# EAGLE schematic CrossBoard v1 (EAGLE 5.11)
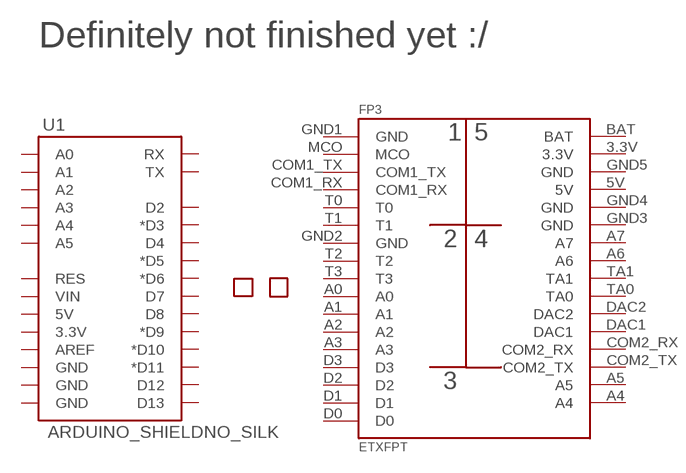
[diagram p0: schematic, sheet 1]

## Parts
FP1  HPBFPNORM  [*HPBFP]
FP2  LPBFPNORM  [*LPBFP]
FP3  ETXFPT  [*ETXFP]
U1  ARDUINO_SHIELDNO_SILK  [DUEMILANOVE_VIAS]
Unconnected: FP3.3.3V FP3.5V FP3.A0 FP3.A1 FP3.A2 FP3.A3 FP3.A4 FP3.A5 FP3.A6 FP3.A7 FP3.BAT FP3.COM1_RX FP3.COM1_TX FP3.COM2_RX FP3.COM2_TX FP3.D0 FP3.D1 FP3.D2 FP3.D3 FP3.DAC1 FP3.DAC2 FP3.GND1(GND) FP3.GND2(GND) FP3.GND3(GND) FP3.GND4(GND) FP3.GND5(GND) FP3.MCO FP3.T0 FP3.T1 FP3.T2 FP3.T3 FP3.TA0 FP3.TA1 U1.3.3V U1.5V U1.A0 U1.A1 U1.A2 U1.A3 U1.A4 U1.A5 U1.AREF U1.D2 U1.D3(*D3) U1.D4 U1.D5(*D5) U1.D6(*D6) U1.D7 U1.D8 U1.D9(*D9) U1.D10(*D10) U1.D11(*D11) U1.D12 U1.D13 U1.GND@0(GND) U1.GND@1(GND) U1.GND@2(GND) U1.RES U1.RX U1.TX U1.VIN

## Notes on the sheet
- Definitely not finished yet :/

## Library data of the parts
FP1 = Pygmy:*HPBFP
FP2 = Pygmy:*LPBFP
FP3 = Pygmy:*ETXFP
U1 = SparkFun:ARDUINO_SHIELD